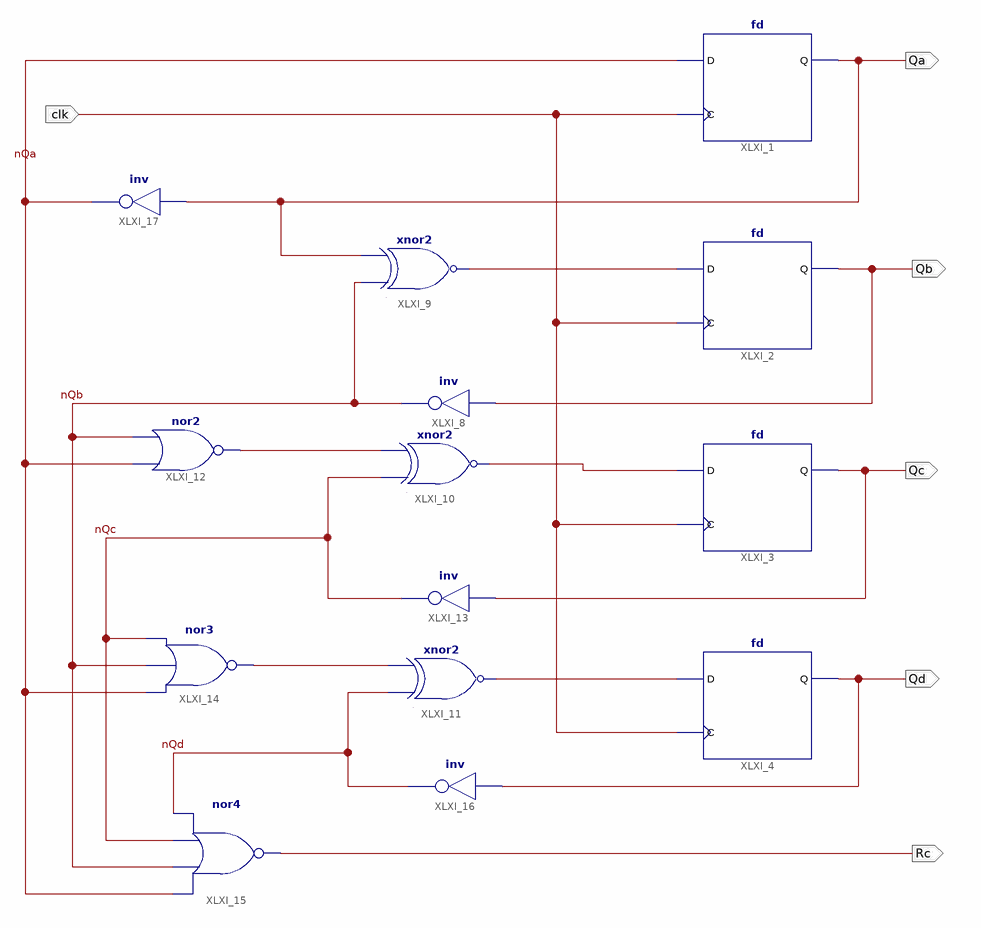
[diagram p0: schematic sheet 1]
// Xilinx ISE schematic counter4.sch (kintex7) as structural Verilog: 14 symbols, 6 ports
module counter4 (
  input  clk,
  output Qb,
  output Qc,
  output Qd,
  output Qa,
  output Rc
);

  wire nQa, nQb, nQc, nQd, XLXN_14, XLXN_15, XLXN_22, XLXN_23, XLXN_30;

  fd XLXI_1 (.C(clk), .D(nQa), .Q(Qa));
  fd XLXI_2 (.C(clk), .D(XLXN_30), .Q(Qb));
  fd XLXI_3 (.C(clk), .D(XLXN_15), .Q(Qc));
  fd XLXI_4 (.C(clk), .D(XLXN_23), .Q(Qd));
  not XLXI_8 (nQb, Qb);
  xnor XLXI_9 (XLXN_30, nQb, Qa);
  xnor XLXI_10 (XLXN_15, nQc, XLXN_14);
  xnor XLXI_11 (XLXN_23, nQd, XLXN_22);
  nor XLXI_12 (XLXN_14, nQa, nQb);
  not XLXI_13 (nQc, Qc);
  nor XLXI_14 (XLXN_22, nQa, nQb, nQc);
  nor XLXI_15 (Rc, nQa, nQb, nQc, nQd);
  not XLXI_16 (nQd, Qd);
  not XLXI_17 (nQa, Qa);
endmodule
